# EAGLE design Barebones ATMega328P (EAGLE 9.6.2)
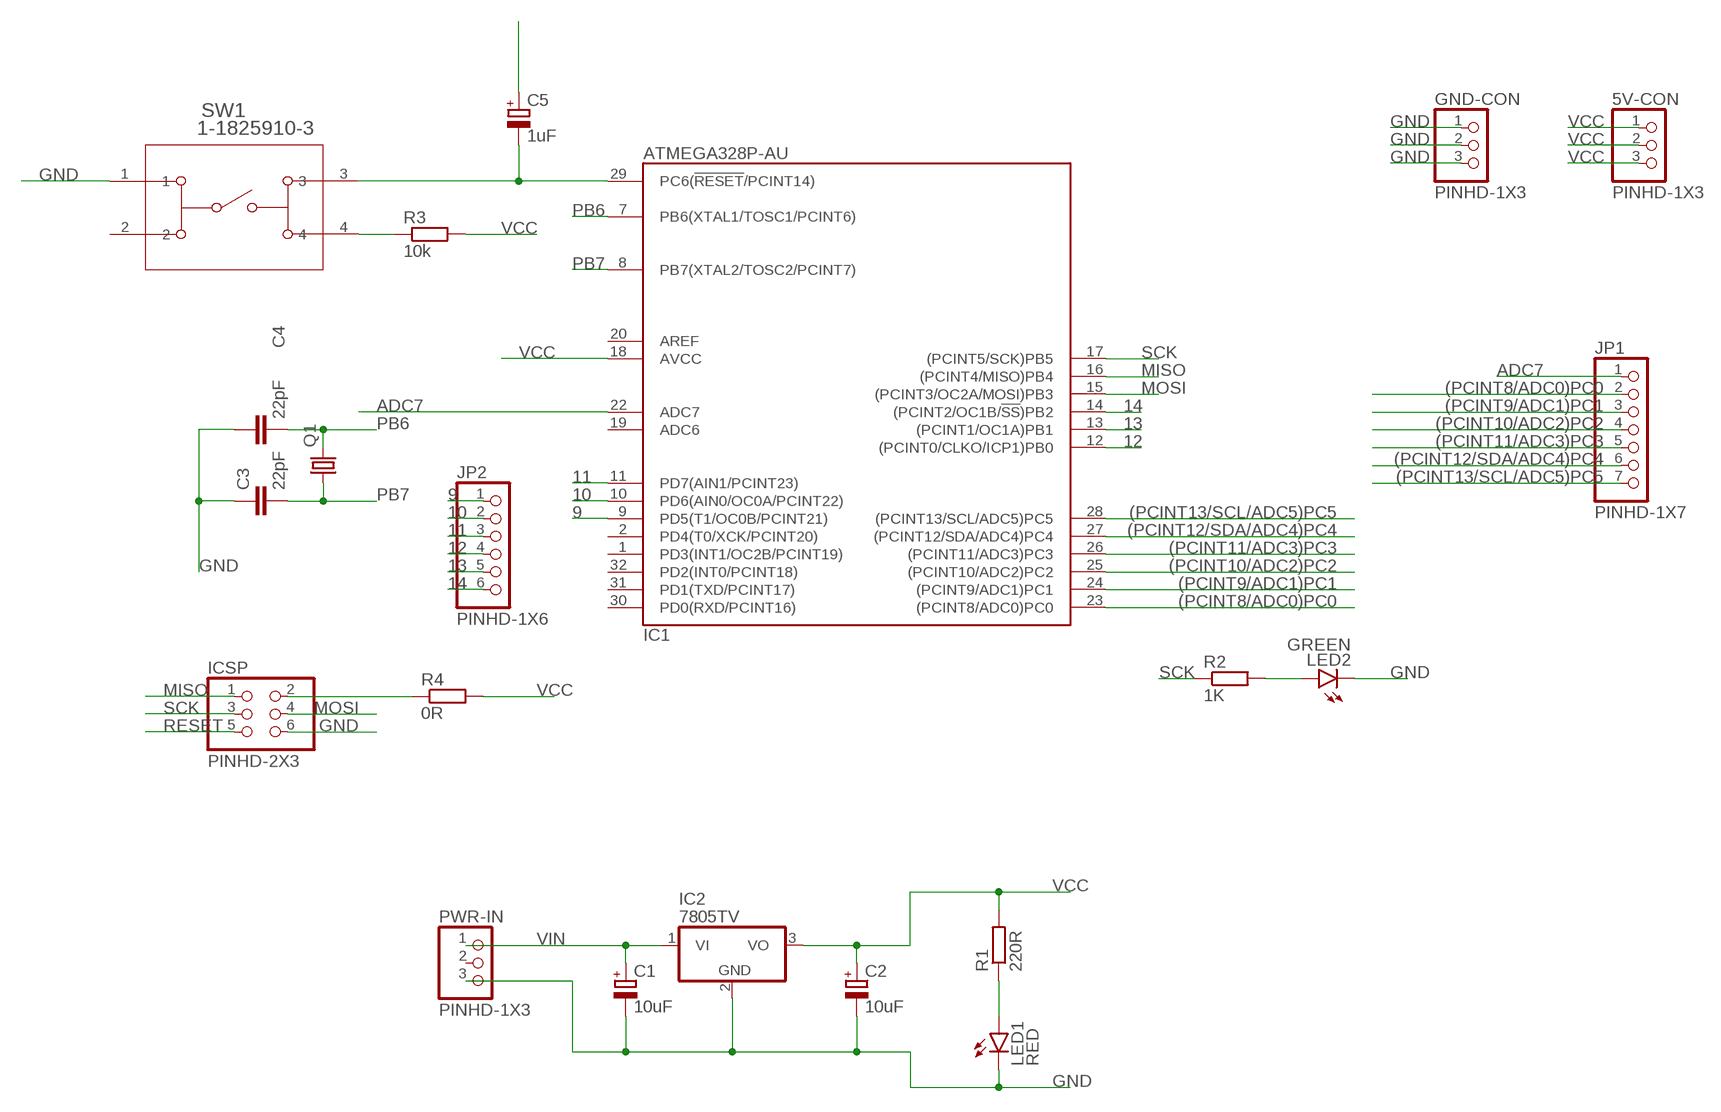
[diagram p0: schematic, sheet 1]

## Parts
5V-CON  PINHD-1X3  [1X03]
C1  10uF  CPOL-EUE5-8.5  [E5-8,5]
C2  10uF  CPOL-EUE5-8.5  [E5-8,5]
C3  22pF  C-EU025-025X050  [C025-025X050]
C4  22pF  C-EU025-025X050  [C025-025X050]
C5  1uF  CPOL-EUE5-8.5  [E5-8,5]
GND-CON  PINHD-1X3  [1X03]
IC1  ATMEGA328P-AU  [QFP32_7X7_0.80]
IC2  7805TV  [TO220V]
ICSP  PINHD-2X3  [2X03]
JP1  PINHD-1X7  [1X07]
JP2  PINHD-1X6  [1X06]
LED1  RED  LED3MM  [LED3MM]
LED2  GREEN  LED3MM  [LED3MM]
PWR-IN  PINHD-1X3  [1X03]
Q1  CRYSTALHC49S  [HC49/S]
R1  220R  R-EU_0207/10  [0207/10]
R2  1K  R-EU_0207/10  [0207/10]
R3  10k  R-EU_0207/10  [0207/10]
R4  0R  R-EU_0207/10  [0207/10]
SW1  1-1825910-3  [SW4_1825910-D]

## Nets
9: IC1.9(PD5(T1/OC0B/PCINT21)) JP2.1
10: IC1.10(PD6(AIN0/OC0A/PCINT22)) JP2.2
11: IC1.11(PD7(AIN1/PCINT23)) JP2.3
12: IC1.12((PCINT0/CLKO/ICP1)PB0) JP2.4
13: IC1.13((PCINT1/OC1A)PB1) JP2.5
14: IC1.14((PCINT2/OC1B/!SS!)PB2) JP2.6
(PCINT8/ADC0)PC0: IC1.23((PCINT8/ADC0)PC0) JP1.2
(PCINT9/ADC1)PC1: IC1.24((PCINT9/ADC1)PC1) JP1.3
(PCINT10/ADC2)PC2: IC1.25((PCINT10/ADC2)PC2) JP1.4
(PCINT11/ADC3)PC3: IC1.26((PCINT11/ADC3)PC3) JP1.5
(PCINT12/SDA/ADC4)PC4: IC1.27((PCINT12/SDA/ADC4)PC4) JP1.6
(PCINT13/SCL/ADC5)PC5: IC1.28((PCINT13/SCL/ADC5)PC5) JP1.7
ADC7: IC1.22(ADC7) JP1.1
GND: C1.- C2.- C3.1 C4.1 GND-CON.1 GND-CON.2 GND-CON.3 IC2.2(GND) ICSP.6 LED1.K(C) LED2.K(C) PWR-IN.3 SW1.1
MISO: IC1.16((PCINT4/MISO)PB4) ICSP.1
MOSI: IC1.15((PCINT3/OC2A/MOSI)PB3) ICSP.4
N$1: LED1.A R1.1
N$2: R3.1 SW1.4
N$3: C5.- IC1.29(PC6(!RESET!/PCINT14)) SW1.3
N$4: ICSP.2 R4.1
N$5: LED2.A R2.2
PB6: C4.2 IC1.7(PB6(XTAL1/TOSC1/PCINT6)) Q1.2
PB7: C3.2 IC1.8(PB7(XTAL2/TOSC2/PCINT7)) Q1.1
RESET: C5.+ ICSP.5
SCK: IC1.17((PCINT5/SCK)PB5) ICSP.3 R2.1
VCC: 5V-CON.1 5V-CON.2 5V-CON.3 C2.+ IC1.18(AVCC) IC2.3(VO) R1.2 R3.2 R4.2
VIN: C1.+ IC2.1(VI) PWR-IN.1
Unconnected: IC1.1(PD3(INT1/OC2B/PCINT19)) IC1.2(PD4(T0/XCK/PCINT20)) IC1.19(ADC6) IC1.20(AREF) IC1.30(PD0(RXD/PCINT16)) IC1.31(PD1(TXD/PCINT17)) IC1.32(PD2(INT0/PCINT18)) PWR-IN.2 SW1.2

## Power pins joined to a net without a drawn wire
GND: IC1.3(GND) IC1.5(GND) IC1.21(GND)
VCC: IC1.4(VCC) IC1.6(VCC)

## Library data of the parts
5V-CON GND-CON PWR-IN = Connector:PINHD-1X3: PIN HEADER; CATEGORY: CONNECTOR; SUB-CATEGORY: PIN-HEADER
C1 C2 C5 = rcl:CPOL-EU: POLARIZED CAPACITOR, European symbol; SPICEPREFIX: C
C3 C4 = rcl:C-EU: CAPACITOR, European symbol; SPICEPREFIX: C
IC1 = atmel:ATMEGA*8: 8-bit AVR Microcontroller 4/8/16/32 kbytes flash 512/1k/1k/2k bytes SRAM 256/512/512/1k bytes EEPROM USART, 6/8-channel 10 bit ADC Pin compatible with Atmega8(L,A) Note: ADC6 and ADC7 are not available in 28-lead packages
IC2 = linear:78*: Positive VOLTAGE REGULATOR Source: http://cache.national.com/ds/LM/LM78L05.pdf http://www.fairchildsemi.com/ds/LM/LM7805.pdf
ICSP = Connector:PINHD-2X3: PIN HEADER; CATEGORY: CONNECTOR; SUB-CATEGORY: PIN-HEADER
JP1 = Connector:PINHD-1X7: PIN HEADER; CATEGORY: CONNECTOR; SUB-CATEGORY: PIN-HEADER
JP2 = Connector:PINHD-1X6: PIN HEADER; CATEGORY: CONNECTOR; SUB-CATEGORY: PIN-HEADER
LED1 LED2 = led:LED: LED OSRAM: - CHIPLED LG R971, LG N971, LY N971, LG Q971, LY Q971, LO R971, LY R971 LH N974, LH R974 LS Q976, LO Q976, LY Q976 LO Q996 - Hyper CHIPLED LW Q18S LB Q993, LB Q99A, LB R99A - SideLED LS A670, LO A670, LY A670, LG A670, LP A670 LB A673, LV A673, LT A673, LW A673 LH A674 LY A675 LS A676, LA A676, LO A676, LY A676, LW A676 LS A679, LY A679, LG A679 - Hyper Micro SIDELED® LS Y876, LA Y876, LO Y876, LY Y876 LT Y87S - SmartLED LW L88C, LW L88S LB L89C, LB L89S, LG L890 LS L89K, LO L89K, LY L89K LS L896, LA L896, LO L896, LY L896 - TOPLED LS T670, LO T670, LY T670, LG T670, LP T670 LSG T670, LSP T670, LSY T670, LOP T670, LYG T670 LG T671, LOG T671, LSG T671 LB T673, LV T673, LT T673, LW T673 LH T674 LS T676, LA T676, LO T676, LY T676, LB T676, LH T676, LSB T676, LW T676 LB T67C, LV T67C, LT T67C, LS T67K, LO T67K, LY T67K, LW E67C LS E67B, LA E67B, LO E67B, LY E67B, LB E67C, LV E67C, LT E67C LW T67C LS T679, LY T679, LG T679 LS T770, LO T770, LY T770, LG T770, LP T770 LB T773, LV T773, LT T773, LW T773 LH T774 LS E675, LA E675, LY E675, LS T675 LS T776, LA T776, LO T776, LY T776, LB T776 LHGB T686 LT T68C, LB T68C - Hyper Mini TOPLED® LB M676 - Mini TOPLED Santana® LG M470 LS M47K, LO M47K, LY M47K Source: http://www.osram.convergy.de LUXEON: - LUMILED® LXK2-PW12-R00, LXK2-PW12-S00, LXK2-PW14-U00, LXK2-PW14-V00 LXK2-PM12-R00, LXK2-PM12-S00, LXK2-PM14-U00 LXK2-PE12-Q00, LXK2-PE12-R00, LXK2-PE12-S00, LXK2-PE14-T00, LXK2-PE14-U00 LXK2-PB12-K00, LXK2-PB12-L00, LXK2-PB12-M00, LXK2-PB14-N00, LXK2-PB14-P00, LXK2-PB14-Q00 LXK2-PR12-L00, LXK2-PR12-M00, LXK2-PR14-Q00, LXK2-PR14-R00 LXK2-PD12-Q00, LXK2-PD12-R00, LXK2-PD12-S00 LXK2-PH12-R00, LXK2-PH12-S00 LXK2-PL12-P00, LXK2-PL12-Q00, LXK2-PL12-R00 Source: www.luxeon.com KINGBRIGHT: KA-3528ASYC Source: www.kingbright.com
Q1 = adafruit:CRYSTAL: CRYSTAL; OC_FARNELL: 1667008; OC_NEWARK: unknown
R1-R4 = rcl:R-EU_: RESISTOR, European symbol; SPICEPREFIX: R
SW1 = Switches:1-1825910-3; BUILT_BY: EMA_UL_Team; CATEGORY: Tactile Switches; CONFIGURATION__POLE-THROW_: Single Pole - Single Throw; COPYRIGHT: Copyright (C) 2016 Accelerated Designs. All rights reserved; DESCRIPTION: FSM8JLH=6MM TACT SWITCH, HIGH TEMP; MANUFACTURER_PART_NUMBER: 1-1825910-3; MAX_SWITCHING_CURRENT: -; MAX_SWITCHING_VOLTAGE_AC_: -; PART_STATUS: active; PRODUCT_TYPE: Switch; SERIES: ?Alcoswitch FSM; SWITCH_TYPE: Tactile Switches; TE_PART_NUMBER: 1-1825910-3; VENDOR: TE Connectivity

## Board
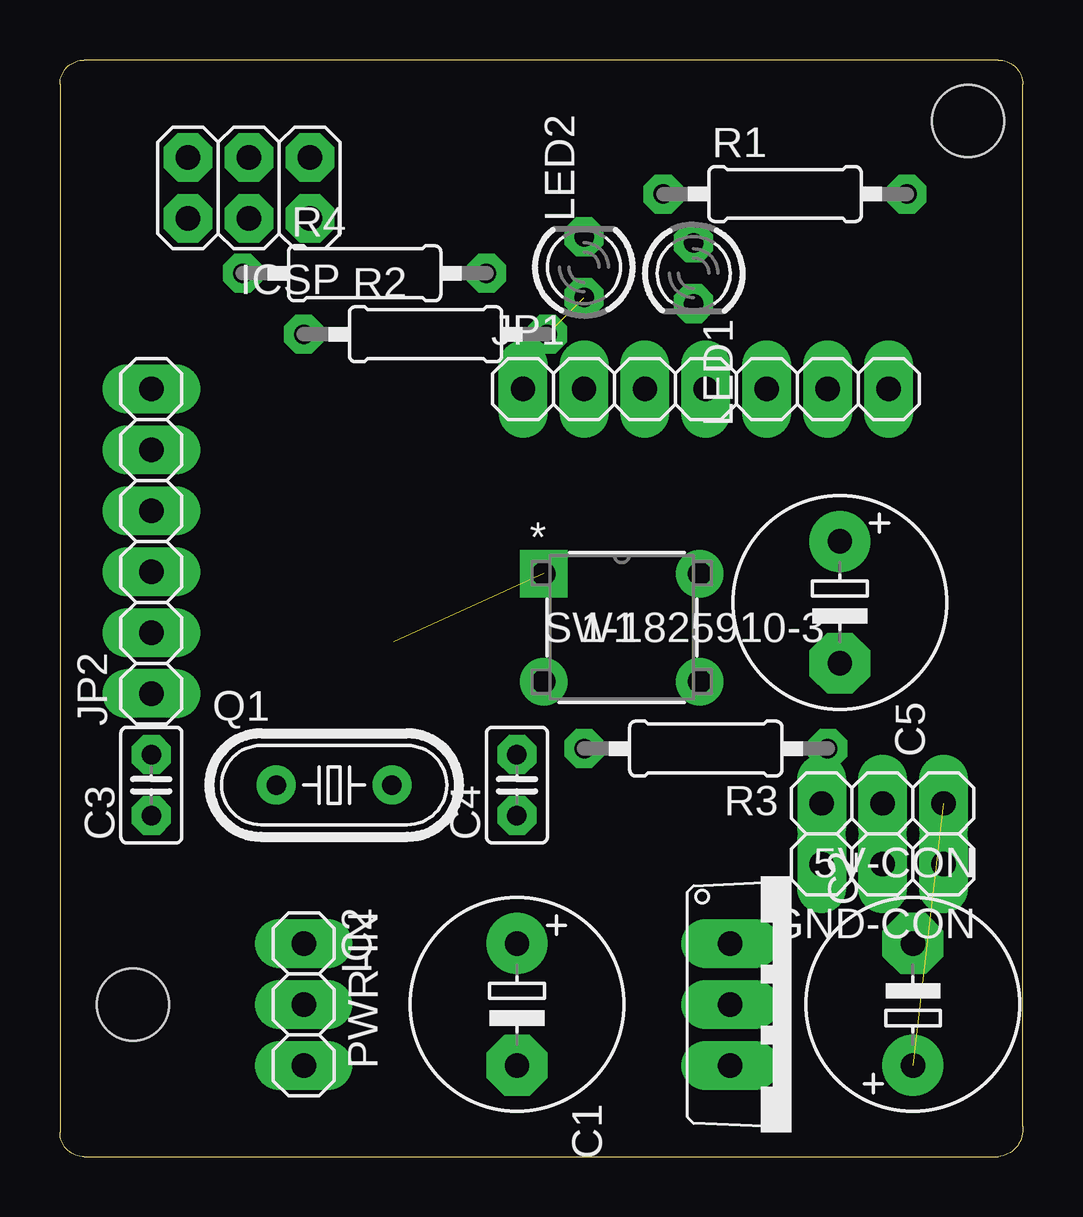
[diagram p1: board, top side]
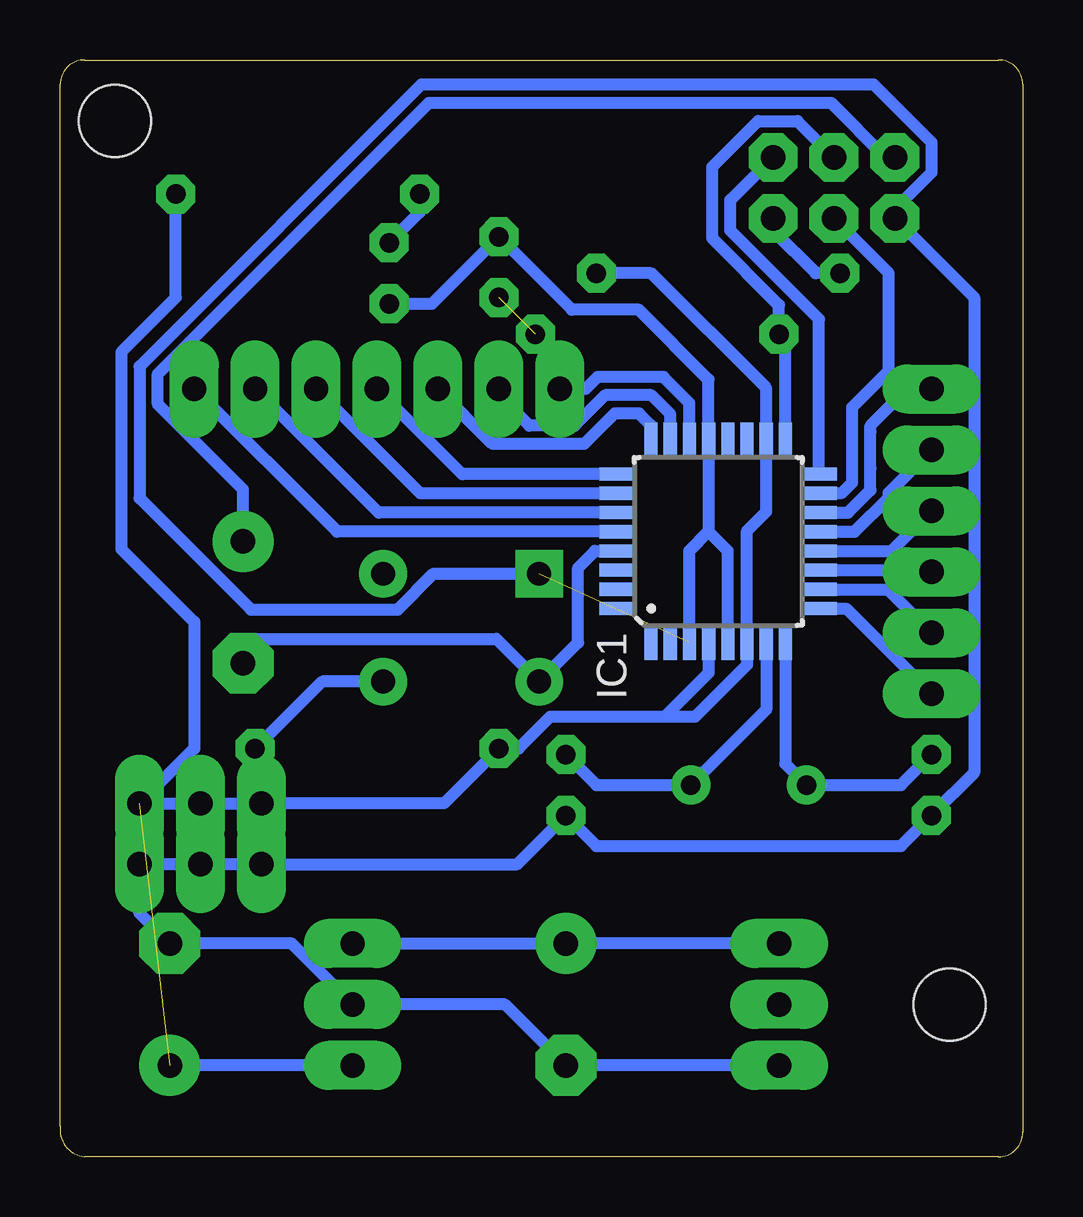
[diagram p2: board, bottom side, seen from below]

Size 40.14 x 45.72 mm. Coordinates in mm from the lower left corner, seen from the top.
Outline: 0,44.7 0,1.02 arc90 1.02,0 39.12,0 arc90 40.13,1.27 40.13,44.7 arc90 39.12,45.72 1.02,45.72 arc90 0,44.7
Copper layers (1*16): Top 0.035mm / dielectric 1.5mm / Bottom 0.035mm
Design rules "swidzi_milling_3018_smd_test": minimum track width 20mil, minimum drill 0.8mm, track to track 0.25mm, track to pad 0.25mm, pad to pad 0.25mm, via to via 6mil, smd to smd 6mil, copper to edge 15mil, drill to drill 6mil, minimum pad ring 10mil, minimum via ring 8mil, stop-mask expansion 4mil, vias tented up to drill 0mil, thermal gap 10mil
Holes 3 mm at 3.05,6.35 37.85,43.18

### Footprints (pad centres in the part's own frame; a part is rotated, then mirrored left to right if it is on the bottom)
1X03 = drill 1.016 long: 1 -2.54,0; 2 0,0; 3 2.54,0
E5-8,5 = drill 1.016 pad 2.54: + -2.54,0 | drill 1.016 pad 2.54 octagon: - 2.54,0
C025-025X050 = drill 0.813 octagon: 1 -1.27,0; 2 1.27,0
QFP32_7X7_0.80 = smd 1.5 x 0.55: 1 -4.2,2.8; 2 -4.2,2; 3 -4.2,1.2; 4 -4.2,0.4; 5 -4.2,-0.4; 6 -4.2,-1.2; 7 -4.2,-2; 8 -4.2,-2.8; 17 4.2,-2.8; 18 4.2,-2; 19 4.2,-1.2; 20 4.2,-0.4; 21 4.2,0.4; 22 4.2,1.2; 23 4.2,2; 24 4.2,2.8 | smd 0.55 x 1.5: 9 -2.8,-4.2; 10 -2,-4.2; 11 -1.2,-4.2; 12 -0.4,-4.2; 13 0.4,-4.2; 14 1.2,-4.2; 15 2,-4.2; 16 2.8,-4.2; 25 2.8,4.2; 26 2,4.2; 27 1.2,4.2; 28 0.4,4.2; 29 -0.4,4.2; 30 -1.2,4.2; 31 -2,4.2; 32 -2.8,4.2
TO220V = drill 1.016 long: 1 -2.54,-2.54; 2 0,-2.54; 3 2.54,-2.54
2X03 = drill 1.016 octagon: 1 -2.54,-1.27; 2 -2.54,1.27; 3 0,-1.27; 4 0,1.27; 5 2.54,-1.27; 6 2.54,1.27
1X07 = drill 1.016 long: 1 -7.62,0; 2 -5.08,0; 3 -2.54,0; 4 0,0; 5 2.54,0; 6 5.08,0; 7 7.62,0
1X06 = drill 1.016 long: 1 -6.35,0; 2 -3.81,0; 3 -1.27,0; 4 1.27,0; 5 3.81,0; 6 6.35,0
LED3MM = drill 0.813 octagon: A -1.27,0; K 1.27,0
HC49/S = drill 0.813: 1 -2.413,0; 2 2.413,0
0207/10 = drill 0.813 octagon: 1 -5.08,0; 2 5.08,0
SW4_1825910-D = drill 0.991 pad 1.499 square: 1 -6.502,4.496 | drill 0.991 pad 1.499: 2 0,4.496; 3 -6.502,0; 4 0,0

### Placement (x,y rotation side)
5V-CON  34.29,14.73 180 top
C1  19.05,6.35 270 top
C2  35.56,6.35 90 top
C3  3.81,15.49 90 top
C4  19.05,15.49 90 top
C5  32.51,23.11 270 top
GND-CON  34.29,12.19 180 top
IC1  12.7,25.65 90 bottom
IC2  30.48,6.35 270 top
ICSP  7.87,40.39 180 top
JP1  26.92,32 0 top
JP2  3.81,25.65 90 top
LED1  26.42,36.83 270 top
LED2  21.84,37.08 90 top
PWR-IN  10.16,6.35 270 top
Q1  11.43,15.49 0 top
R1  30.23,40.13 0 top
R2  15.24,34.29 0 top
R3  26.92,17.02 180 top
R4  12.7,36.83 0 top
SW1  26.67,19.81 0 top

### Tracks (layer width: path | path; a pad name or v marks a point on that pad's centre or on a via)
9
  Bottom 0.508: IC1.9 7.36,22.85 JP2.1
10
  Bottom 0.508: IC1.10 5.62,23.65 JP2.2
11
  Bottom 0.508: IC1.11 3.88,24.45 JP2.3
12
  Bottom 0.508: IC1.12 5.48,25.25 JP2.4
13
  Bottom 0.508: JP2.5 5.6,27.68 5.6,27.48 7.02,26.05 IC1.13
14
  Bottom 0.508: IC1.14 7.29,26.85 6.35,27.79 6.35,28.7 6.35,30.23 6.35,30.48 4.83,32 JP2.6
(PCINT8/ADC0)PC0
  Bottom 0.508: IC1.23 14.7,30.96 15.49,31.75 17.41,31.75 18.68,30.48 20.57,30.48 21.84,31.75 JP1.2
(PCINT9/ADC1)PC1
  Bottom 0.508: IC1.24 15.5,30.49 16,30.99 17.02,30.99 18.29,29.72 22.1,29.72 JP1.3
(PCINT10/ADC2)PC2
  Bottom 0.508: IC1.25 23.37,28.45 JP1.4
(PCINT11/ADC3)PC3
  Bottom 0.508: IC1.26 25.11,27.65 JP1.5
(PCINT12/SDA/ADC4)PC4
  Bottom 0.508: IC1.27 26.85,26.85 JP1.6
(PCINT13/SCL/ADC5)PC5
  Bottom 0.508: IC1.28 28.59,26.05 JP1.7
ADC7
  Bottom 0.508: IC1.22 13.9,31.43 14.98,32.5 17.73,32.5 18.23,32 JP1.1
GND  (1 unrouted)
  Bottom 0.508: PWR-IN.3 C1.- 21.59,6.35 IC2.2 30.48,8.89 C2.- 36.83,10.16 GND-CON.1 GND-CON.2 GND-CON.3 21.08,12.19 C4.1 17.78,12.95 5.08,12.95 C3.1 2.03,16 2.03,35.81 ICSP.6 5.33,39.51 3.81,41.03 3.81,42.29 6.22,44.69 25.08,44.69 36.82,32.95 36.82,27.45 32.18,22.81 26.05,22.81 24.56,24.31 SW1.1 | IC1.5 12.3,25.25 13.1,26.05 | IC1.3 13.9,25.25 13.1,26.05 | 13.1,26.05 IC1.21 13.1,32.4 16,35.31 18.8,35.31 LED2.K 24.64,35.56 LED1.K
MISO
  Bottom 0.508: IC1.16 8.5,34.92 12.19,38.61 12.19,39.88 ICSP.1
MOSI
  Bottom 0.508: IC1.15 8.48,27.68 7.54,27.68 7.11,28.1 7.11,31.24 5.59,32.77 5.59,36.83 ICSP.4
N$1
  Bottom 0.508: LED1.A 25.15,39.37 R1.1
N$2
  Bottom 0.508: R3.1 29.21,19.81 SW1.4
N$3
  Bottom 0.508: 20.17,20.47 SW1.3 | SW1.3 18.54,21.44 18.54,24.55 17.84,25.25 IC1.29 | SW1.3 21.95,21.59 32,21.59 32.51,21.08 C5.-
N$4
  Bottom 0.508: R4.1 8.64,36.83 10.41,38.61 ICSP.2
N$5  (1 unrouted)
PB6
  Bottom 0.508: C4.2 17.78,15.49 Q1.2 10.7,18.64 IC1.7
PB7
  Bottom 0.508: IC1.8 9.9,16.38 Q1.1 5.08,15.49 C3.2
RESET
  Bottom 0.508: ICSP.5 5.72,41.66 8,43.93 24.76,43.93 36.06,32.63 36.06,31.37 32.51,27.82 C5.+
SCK
  Bottom 0.508: IC1.17 9.9,34.03 R2.1 10.16,35.5 12.95,38.29 12.95,41.27 11.04,43.18 9.39,43.18 ICSP.3
VCC  (1 unrouted)
  Bottom 0.508: IC2.3 C2.+ | 14.94,18.34 13.66,18.34 11.5,20.5 IC1.6 11.5,26.09 10.7,26.89 IC1.18 10.7,32.04 15.49,36.83 R4.2 | 14.94,18.34 19.7,18.34 21.02,17.02 R3.2 24.13,14.73 5V-CON.3 5V-CON.2 5V-CON.1 34.54,17.02 34.54,22.3 37.58,25.33 37.58,33.54 35.31,35.81 R1.2 | IC1.4 13.1,20.17 14.94,18.34
VIN
  Bottom 0.508: PWR-IN.1 C1.+ IC2.1